# Altium schematic sheet Common-Emmiter Amplifier.schdoc: Common Emitter Amplifier
size A4; Organization: Altium Limited; Address1: L3, 12a Rodborough Rd; Address2: Frenchs Forest; Address3: NSW; Address4: Australia 2086; DocumentNumber: 1; SheetNumber: 1; SheetTotal: 1
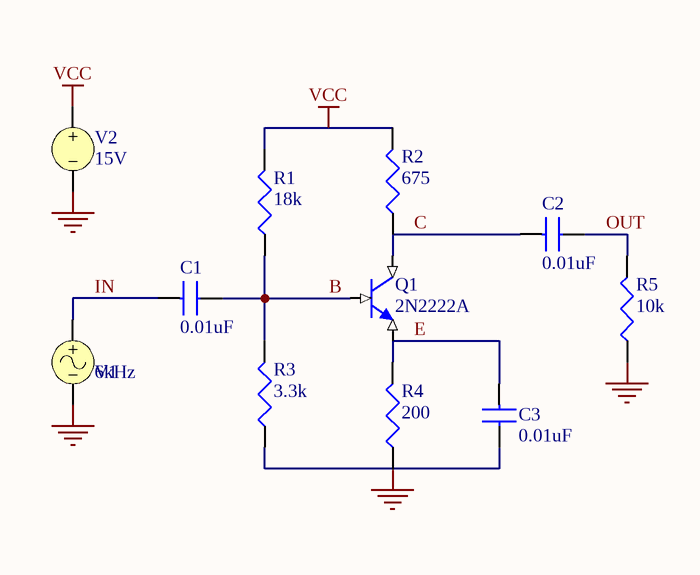
[diagram p0: Common-Emmiter Amplifier.schdoc]

## Parts
C1  0.01uF
C2  0.01uF
C3  0.01uF
Q1  2N2222A
R1  18k
R2  675
R3  3.3k
R4  200
R5  10k
V1  6kHz
V2  15V

## Nets
GND: C3.2 R3.2(BOT) R4.2(BOT) R5.2(BOT) V1.2 V2.2
VCC: R1.1(TOP) R2.1(TOP) V2.1
B: C1.2 Q1.2(B) R1.2(BOT) R3.1(TOP)
C: C2.1 Q1.1(C) R2.2(BOT)
E: C3.1 Q1.3(E) R4.1(TOP)
IN: C1.1 V1.1
OUT: C2.2 R5.1(TOP)

## Notes on the sheet
- Title
- Size:
- Date:
- A4
- Number:
- Time:
- Revision:
- Sheet
- of
- File:

## Library data of the parts
C1-C3 = CAP: Capacitor; Value: 0.01uF
Q1 = 2N2222A: NPN BJT
R1-R5 = RES: Resistor
  R1: Value: 18k
  R2: Value: 675
  R3: Value: 3.3k
  R4: Value: 200
  R5: Value: 10k
V1 = VSIN: Sinusoidal Voltage Source
V2 = VSRC: Voltage Source; Value: 15V